# EAGLE design samd21_actuatorhub_pro_1.0.1_may2023 (EAGLE 9.6.2)
VERSION: V1.1 Jan 2022

## Sheet 1 of 3
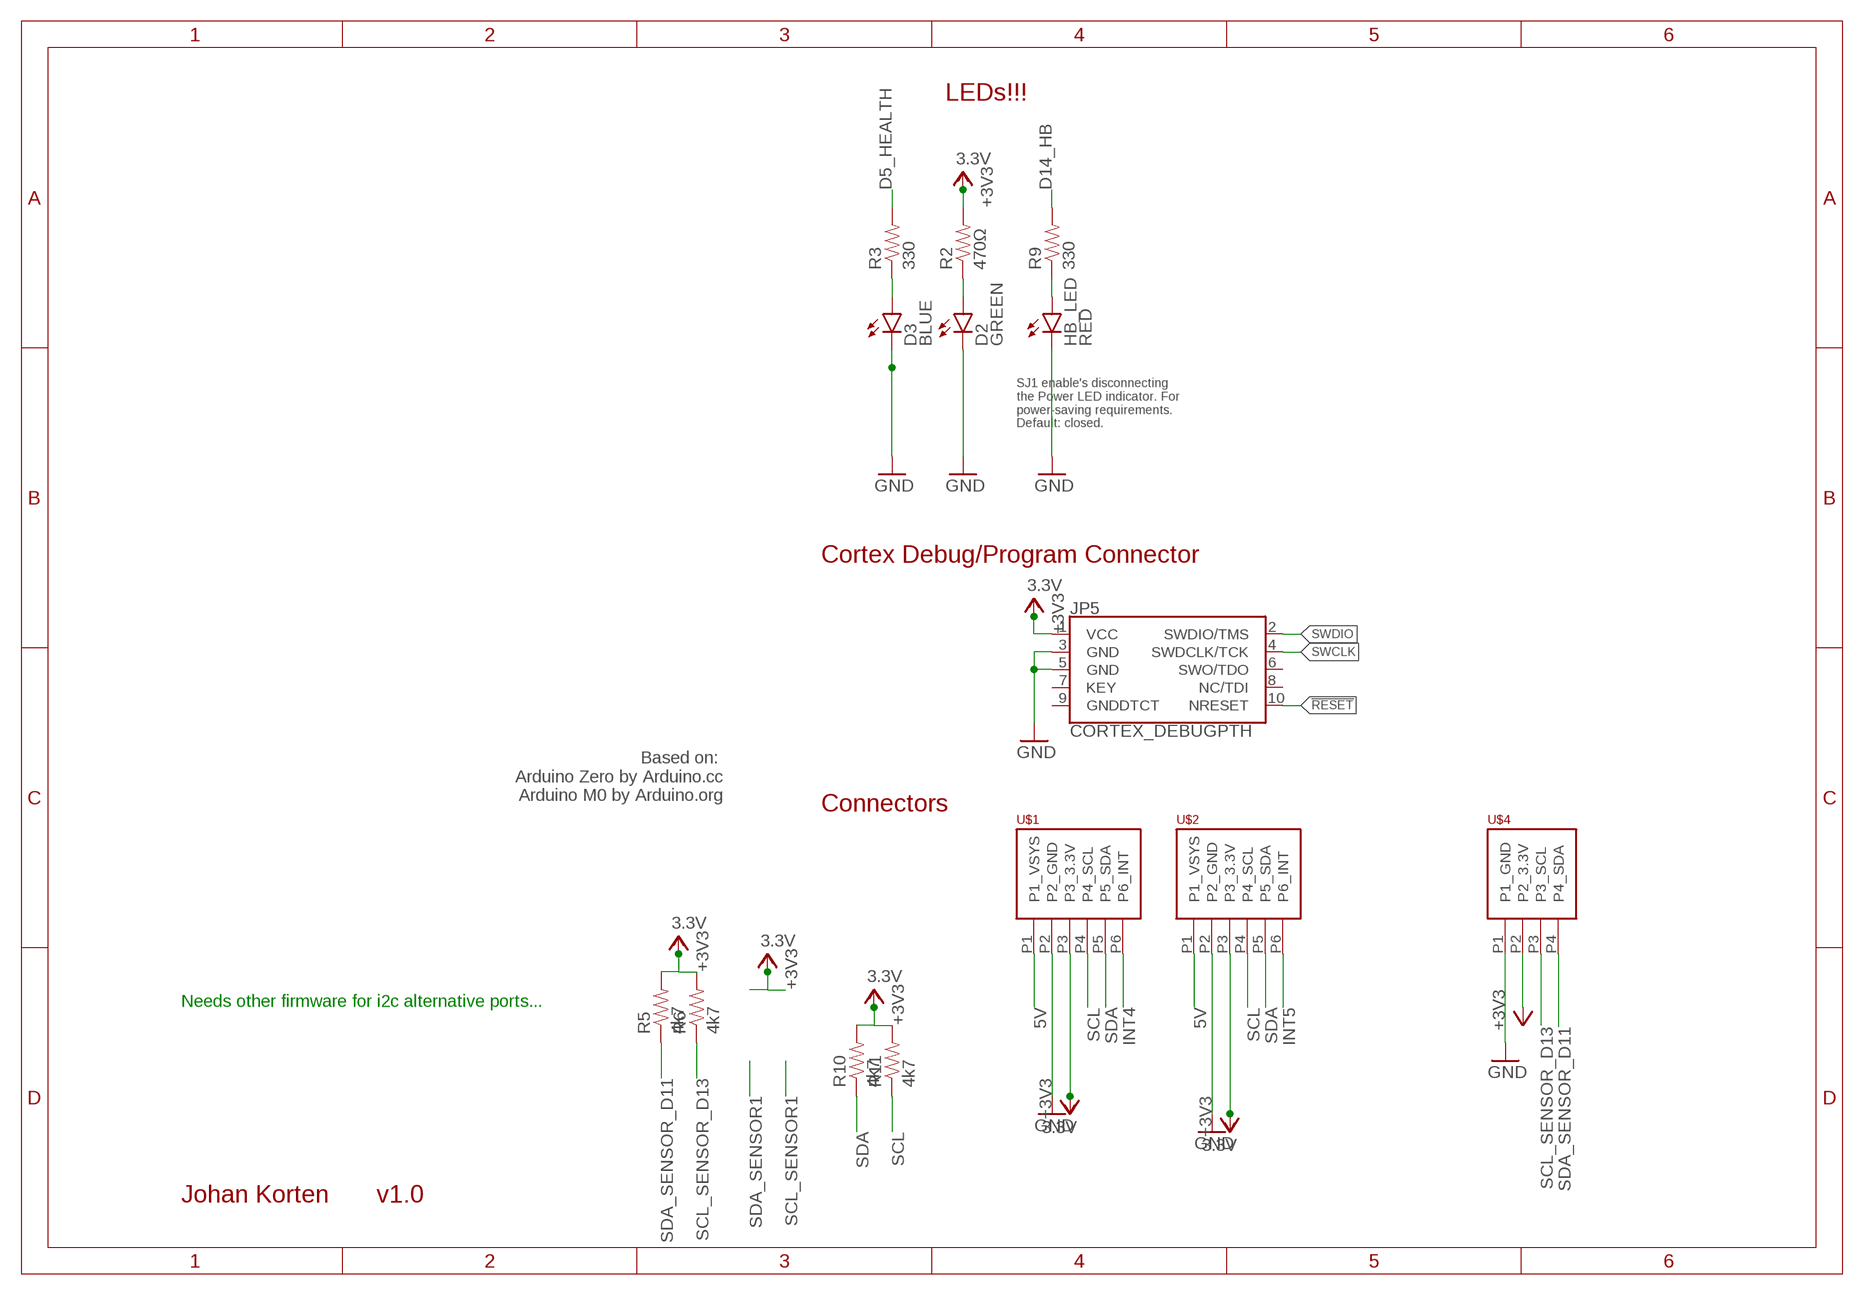
[diagram p0: schematic, sheet 1]

### Parts
D2  GREEN  LED-RED0603  [LED-0603]
D3  BLUE  LED-BLUE0603  [LED-0603]
HB_LED  RED  LED-RED0603  [LED-0603]
JP5  CORTEX_DEBUGPTH  [2X5-PTH-1.27MM]
R2  470Ω  330OHM1/10W1%(0603)  [0603-RES]
R3  330  330OHM1/10W1%(0603)  [0603-RES]
R5  4k7  330OHM1/10W1%(0603)  [0603-RES]
R6  4k7  330OHM1/10W1%(0603)  [0603-RES]
R9  330  330OHM1/10W1%(0603)  [0603-RES]
R10  4k7  330OHM1/10W1%(0603)  [0603-RES]
R11  4k7  330OHM1/10W1%(0603)  [0603-RES]
U$1  PHOENIX_PTSM_M6_TH_I2CPPANGLE  [PTSM_M6_THRHOLE]
U$2  PHOENIX_PTSM_M6_TH_I2CPPANGLE  [PTSM_M6_THRHOLE]
U$4  PHOENIX_PTSM_M4_THANGLE  [PTSM_M4_TH]

### Nets
3.3V [power]: JP5.1(VCC) R2.2 R5.2 R6.2 R10.2 R11.2 U$1.P3(P3_3.3V) U$2.P3(P3_3.3V) U$4.P2(P2_3.3V) ; supply symbol labelled +3V3 ; also sheet 2
5V [power]: U$1.P1(P1_VSYS) U$2.P1(P1_VSYS) ; also sheet 2,3
!RESET: JP5.10(NRESET) ; also sheet 2
D5_HEALTH: R3.2 ; also sheet 2
D5_HEALTH_LED: D3.A R3.1
D14_HB: R9.2 ; also sheet 2
D14_HB_LED: HB_LED.A R9.1
GND [ground]: D2.C D3.C HB_LED.C JP5.3(GND) JP5.5(GND) U$1.P2(P2_GND) U$2.P2(P2_GND) U$4.P1(P1_GND) ; also sheet 2,3
INT4: U$1.P6(P6_INT) ; also sheet 2
INT5: U$2.P6(P6_INT) ; also sheet 2
N$5: D2.A R2.1
SCL: R11.1 U$1.P4(P4_SCL) U$2.P4(P4_SCL) ; also sheet 2
SCL_SENSOR_D13: R6.1 U$4.P3(P3_SCL) ; also sheet 2
SDA: R10.1 U$1.P5(P5_SDA) U$2.P5(P5_SDA) ; also sheet 2
SDA_SENSOR_D11: R5.1 U$4.P4(P4_SDA) ; also sheet 2
SWCLK: JP5.4(SWDCLK/TCK) ; also sheet 2
SWDIO: JP5.2(SWDIO/TMS) ; also sheet 2
Unconnected: JP5.6(SWO/TDO) JP5.7(KEY) JP5.8(NC/TDI) JP5.9(GNDDTCT)

### Notes on the sheet
- LEDs!!!
- SJ1 enable's disconnecting
  the Power LED indicator. For
  power-saving requirements.
  Default: closed.
- Cortex Debug/Program Connector
- Based on: 
  Arduino Zero by Arduino.cc
  Arduino M0 by Arduino.org
- Connectors
- Needs other firmware for i2c alternative ports...
- Johan Korten | v1.0

## Sheet 2 of 3: Controller SAMD21 based on Adafruit Feather M0 Express
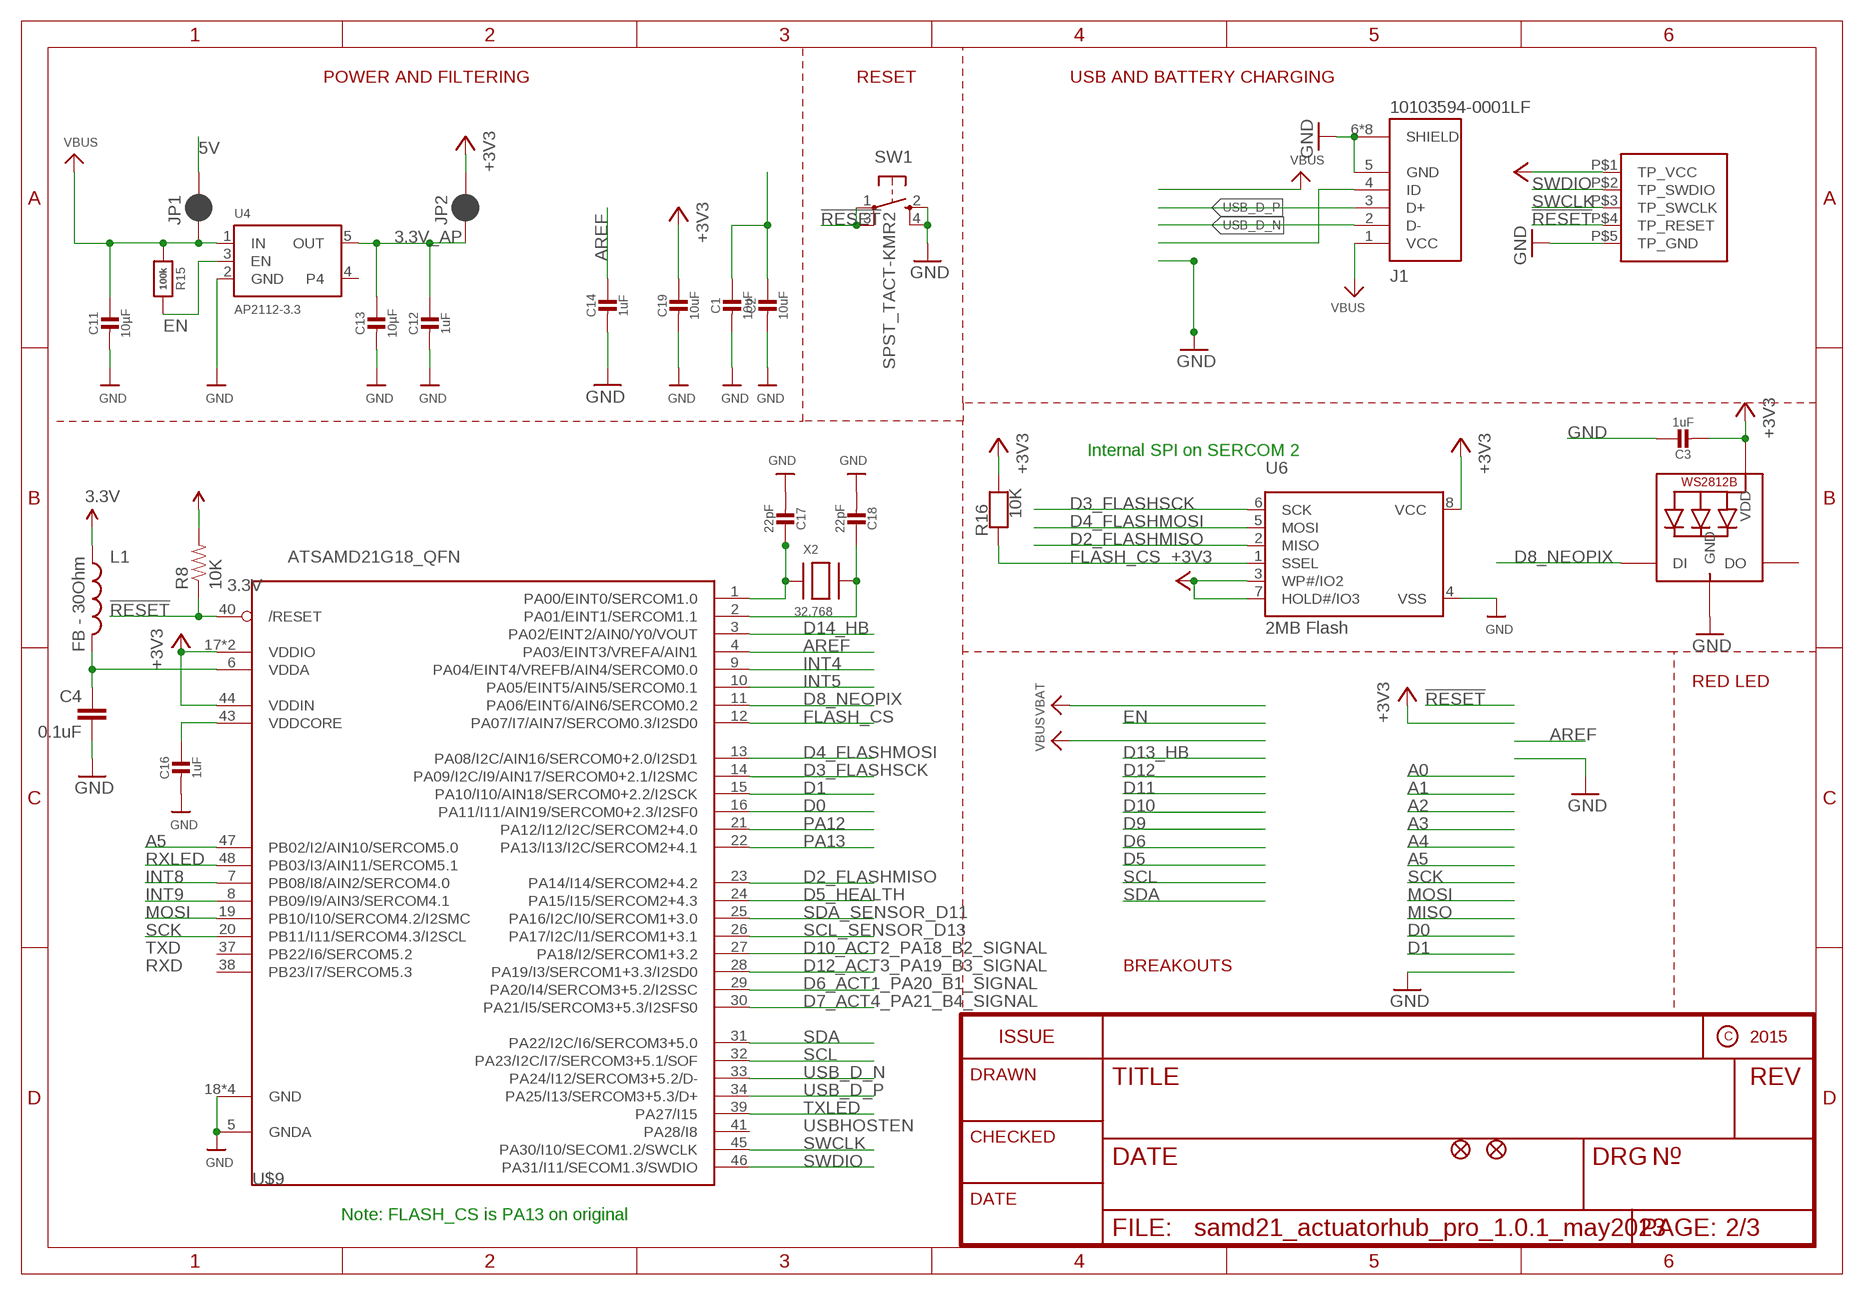
[diagram p1: schematic, sheet 2]

### Parts
C1  10uF  CAP_CERAMIC0805-NOOUTLINE  [0805-NO]
C2  10uF  CAP_CERAMIC0805-NOOUTLINE  [0805-NO]
C3  1uF  CAP_CERAMIC0603_NO  [0603-NO]
C4  0.1uF  0.1UF-16V(+-10%)(0402)  [0402-CAP]
C11  10µF  CAP_CERAMIC0805-NOOUTLINE  [0805-NO]
C12  1uF  CAP_CERAMIC0603_NO  [0603-NO]
C13  10µF  CAP_CERAMIC0805-NOOUTLINE  [0805-NO]
C14  1uF  CAP_CERAMIC0603_NO  [0603-NO]
C16  1uF  CAP_CERAMIC0603_NO  [0603-NO]
C17  22pF  CAP_CERAMIC0603_NO  [0603-NO]
C18  22pF  CAP_CERAMIC0603_NO  [0603-NO]
C19  10uF  CAP_CERAMIC0805-NOOUTLINE  [0805-NO]
J1  10103594-0001LF  [AMPHENOL_10103594-0001LF]
JP1  JUMPER-SMT_2_NC_PASTE_SILK  [SMT-JUMPER_2_NC_PASTE_SILK]
JP2  JUMPER-SMT_2_NC_PASTE_SILK  [SMT-JUMPER_2_NC_PASTE_SILK]
L1  FB - 30Ohm  INDUCTOR0603  [0603]
LED1  WS2812B3535  [LED3535]
R8  10K  10KOHM-1/10W-1%(0603)0603  [0603-RES]
R15  100k  RESISTOR_0603_NOOUT  [0603-NO]
R16  10K  RESISTOR_0603_NOOUT  [0603-NO]
SW1  SPST_TACT-KMR2  [KMR2]
U4  AP2112-3.3  VREG_SOT23-5  [SOT23-5]
U6  2MB Flash  SPIFLASH_SOIC8208MIL  [SOIC8_208MIL]
U$5  HUB_TESTPINSHUBS  [TEST_PINS]
U$9  ATSAMD21G18_QFN  ATSAMD21G_QFN  [TQFN48_7MM]
U$34  FIDUCIAL""  [FIDUCIAL_1MM]
U$35  FIDUCIAL""  [FIDUCIAL_1MM]
X2  32.768  XTAL-3.2X1.5  [XTAL3215]

### Nets
3.3V [power]: C3.2 C19.1 JP2.2 L1.1 LED1.2(VDD) R8.2 R16.2 U6.3(WP#/IO2) U6.7(HOLD#/IO3) U6.8(VCC) U$5.P$1(TP_VCC) U$9.17(VDDIO) U$9.36(VDDIO) U$9.44(VDDIN) ; supply symbol labelled +3V3 ; also sheet 1
3.3V_AP [power]: C12.1 C13.1 JP2.1 U4.5(OUT)
5V [power]: C1.1 C2.1 JP1.2 ; also sheet 1,3
!RESET: R8.1 SW1.1(P) SW1.3(P1) U$5.P$4(TP_RESET) U$9.40(/RESET) ; also sheet 1
A5: U$9.47(PB02/I2/AIN10/SERCOM5.0)
AREF [power]: C14.1 U$9.4(PA03/EINT3/VREFA/AIN1)
D0: U$9.16(PA11/I11/AIN19/SERCOM0+2.3/I2SF0)
D1: U$9.15(PA10/I10/AIN18/SERCOM0+2.2/I2SCK)
D2_FLASHMISO: U6.2(MISO) U$9.23(PA14/I14/SERCOM2+4.2)
D3_FLASHSCK: U6.6(SCK) U$9.14(PA09/I2C/I9/AIN17/SERCOM0+2.1/I2SMC)
D4_FLASHMOSI: U6.5(MOSI) U$9.13(PA08/I2C/AIN16/SERCOM0+2.0/I2SD1)
D5_HEALTH: U$9.24(PA15/I15/SERCOM2+4.3) ; also sheet 1
D6_ACT1_PA20_B1_SIGNAL: U$9.29(PA20/I4/SERCOM3+5.2/I2SSC) ; also sheet 3
D7_ACT4_PA21_B4_SIGNAL: U$9.30(PA21/I5/SERCOM3+5.3/I2SFS0) ; also sheet 3
D8_NEOPIX: LED1.1(DI) U$9.11(PA06/EINT6/AIN6/SERCOM0.2)
D10_ACT2_PA18_B2_SIGNAL: U$9.27(PA18/I2/SERCOM1+3.2) ; also sheet 3
D12_ACT3_PA19_B3_SIGNAL: U$9.28(PA19/I3/SERCOM1+3.3/I2SD0) ; also sheet 3
D14_HB: U$9.3(PA02/EINT2/AIN0/Y0/VOUT) ; also sheet 1
EN: R15.2 U4.3(EN)
FLASH_CS: R16.1 U6.1(SSEL) U$9.12(PA07/I7/AIN7/SERCOM0.3/I2SD0)
GND [ground]: C1.2 C2.2 C3.1 C4.2 C11.2 C12.2 C13.2 C14.2 C16.2 C17.2 C18.2 C19.2 J1.5(GND) J1.6(SHIELD) J1.7(SHIELD) J1.8(SHIELD) J1.9(SHIELD) J1.10(SHIELD) J1.11(SHIELD) J1.S1(SHIELD) J1.S2(SHIELD) LED1.4(GND) SW1.2(S) SW1.4(S1) U4.2(GND) U6.4(VSS) U$5.P$5(TP_GND) U$9.5(GNDA) U$9.18(GND) U$9.35(GND) U$9.42(GND) U$9.THERMAL(GND) ; also sheet 1,3
INT4: U$9.9(PA04/EINT4/VREFB/AIN4/SERCOM0.0) ; also sheet 1
INT5: U$9.10(PA05/EINT5/AIN5/SERCOM0.1) ; also sheet 1
INT8: U$9.7(PB08/I8/AIN2/SERCOM4.0)
INT9: U$9.8(PB09/I9/AIN3/SERCOM4.1)
MOSI: U$9.19(PB10/I10/SERCOM4.2/I2SMC)
N$8: J1.4(ID)
N$15: C17.1 U$9.1(PA00/EINT0/SERCOM1.0) X2.P$1
N$17: C18.1 U$9.2(PA01/EINT1/SERCOM1.1) X2.P$2
PA12: U$9.21(PA12/I12/I2C/SERCOM2+4.0)
PA13: U$9.22(PA13/I13/I2C/SERCOM2+4.1)
RXLED: U$9.48(PB03/I3/AIN11/SERCOM5.1)
SCK: U$9.20(PB11/I11/SERCOM4.3/I2SCL)
SCL: U$9.32(PA23/I2C/I7/SERCOM3+5.1/SOF) ; also sheet 1
SCL_SENSOR_D13: U$9.26(PA17/I2C/I1/SERCOM1+3.1) ; also sheet 1
SDA: U$9.31(PA22/I2C/I6/SERCOM3+5.0) ; also sheet 1
SDA_SENSOR_D11: U$9.25(PA16/I2C/I0/SERCOM1+3.0) ; also sheet 1
SWCLK: U$5.P$3(TP_SWCLK) U$9.45(PA30/I10/SECOM1.2/SWCLK) ; also sheet 1
SWDIO: U$5.P$2(TP_SWDIO) U$9.46(PA31/I11/SECOM1.3/SWDIO) ; also sheet 1
TXLED: U$9.39(PA27/I15)
USB_D_N [usb]: J1.2(D-) U$9.33(PA24/I12/SERCOM3+5.2/D-)
USB_D_P [usb]: J1.3(D+) U$9.34(PA25/I13/SERCOM3+5.3/D+)
VBUS [power]: C11.1 J1.1(VCC) JP1.1 R15.1 U4.1(IN)
VDDANA: C4.1 L1.2 U$9.6(VDDA)
VDDCORE1: C16.1 U$9.43(VDDCORE)
Unconnected: LED1.3(DO) U4.4 U$9.37(PB22/I6/SERCOM5.2) U$9.38(PB23/I7/SERCOM5.3) U$9.41(PA28/I8)

### Notes on the sheet
- POWER AND FILTERING | RESET | USB AND BATTERY CHARGING
- Internal SPI on SERCOM 2
- RED LED
- TXD
- RXD | BREAKOUTS
- USBHOSTEN
- Note: FLASH_CS is PA13 on original

## Sheet 3 of 3
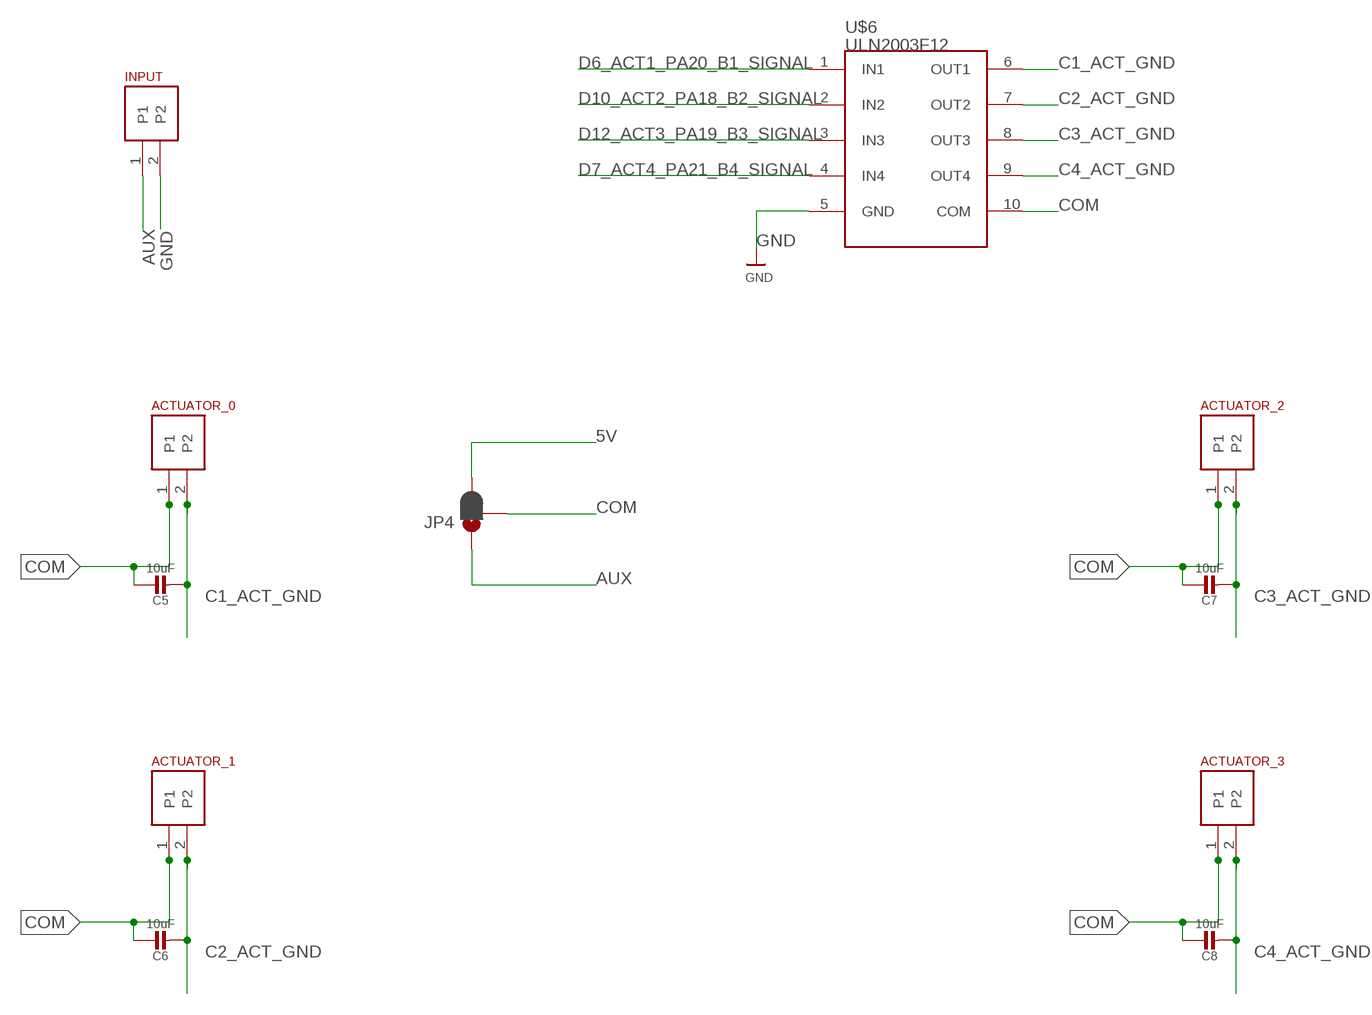
[diagram p2: schematic, sheet 3]

### Parts
ACTUATOR_0  PHOENIX_PTSM_M2_TH  [PTSM_M2_THRHOLE]
ACTUATOR_1  PHOENIX_PTSM_M2_TH  [PTSM_M2_THRHOLE]
ACTUATOR_2  PHOENIX_PTSM_M2TH  [PTSM_M2_THRHOLE]
ACTUATOR_3  PHOENIX_PTSM_M2TH  [PTSM_M2_THRHOLE]
C5  10uF  CAP_CERAMIC0805-NOOUTLINE  [0805-NO]
C6  10uF  CAP_CERAMIC0805-NOOUTLINE  [0805-NO]
C7  10uF  CAP_CERAMIC0805-NOOUTLINE  [0805-NO]
C8  10uF  CAP_CERAMIC0805-NOOUTLINE  [0805-NO]
INPUT  PHOENIX_PTSM_M2_TH  [PTSM_M2_THRHOLE]
JP4  JUMPER-SMT_3_1-NC_PASTE_SILK  [SMT-JUMPER_3_1-NC_PASTE_SILK]
U$6  ULN2003F12  [U-DFN3030-10]

### Nets
5V [power]: JP4.3 ; also sheet 1,2
AUX: INPUT.1 JP4.1
C1_ACT_GND: ACTUATOR_0.2 C5.2 U$6.6(OUT1)
C2_ACT_GND: ACTUATOR_1.2 C6.2 U$6.7(OUT2)
C3_ACT_GND: ACTUATOR_2.2 C7.2 U$6.8(OUT3)
C4_ACT_GND: ACTUATOR_3.2 C8.2 U$6.9(OUT4)
COM: ACTUATOR_0.1 ACTUATOR_1.1 ACTUATOR_2.1 ACTUATOR_3.1 C5.1 C6.1 C7.1 C8.1 JP4.2 U$6.10(COM)
D6_ACT1_PA20_B1_SIGNAL: U$6.1(IN1) ; also sheet 2
D7_ACT4_PA21_B4_SIGNAL: U$6.4(IN4) ; also sheet 2
D10_ACT2_PA18_B2_SIGNAL: U$6.2(IN2) ; also sheet 2
D12_ACT3_PA19_B3_SIGNAL: U$6.3(IN3) ; also sheet 2
GND [ground]: INPUT.2 U$6.5(GND) ; also sheet 1,2

## Library data of the parts
ACTUATOR_0 ACTUATOR_1 INPUT = jk_customs:PHOENIX_PTSM_M2_TH
ACTUATOR_2 ACTUATOR_3 = jk_customs:PHOENIX_PTSM_M2
C1-C3 C5-C8 C11-C14 C16-C19 = microbuilder:CAP_CERAMIC: Ceramic Capacitors For new designs, use the packages preceded by an '_' character since they are more reliable: The following footprints should be used on most boards: _0402 - Standard footprint for regular board layouts _0603 - Standard footprint for regular board layouts _0805 - Standard footprint for regular board layouts _1206 - Standard footprint for regular board layouts For extremely tight-pitch boards where space is at a premium, the following 'micro-pitch' footprints can be used (smaller pads, no silkscreen outline, etc.): _0402MP - Micro-pitch footprint for very dense/compact boards _0603MP - Micro-pitch footprint for very dense/compact boards _0805MP - Micro-pitch footprint for very dense/compact boards _1206MP - Micro-pitch footprint for very dense/compact boards
C4 = SparkFun-Capacitors:0.1UF-16V(+-10%)(0402); PROD_ID: CAP-12416
D2 = SparkFun-LED:LED-RED: Assorted Red LEDs LilyPad 1206- DIO-09912 1206- DIO-00809 0603- DIO-00819 "SMART" means more efficient and expensive; PROD_ID: DIO-00819; VALUE: RED
D3 = SparkFun-LED:LED-BLUE: Blue LEDs for production use Various blue LEDs stocked by SparkFun production 0603 - DIO-08575 Rebel - DIO-09553 1206 - DIO-09911; PROD_ID: DIO-08575
HB_LED = SparkFun-LED:LED-RED: Assorted Red LEDs LilyPad 1206- DIO-09912 1206- DIO-00809 0603- DIO-00819 "SMART" means more efficient and expensive; PROD_ID: DIO-00819
J1 = 10103594-0001LF:10103594-0001LF: USB - micro B USB 2.0 Receptacle Connector 5 Position Surface Mount, Right Angle; Through Hole Check availability <https://pricing.snapeda.com/parts/10103594-0001LF/AMPHENOL%20ICC%20/%20FCI/view-part?ref=eda>; AVAILABILITY: In Stock; DESCRIPTION: Micro USB 2.0, Input Output Connectors, B TYPE RECEPTACLE; MF: AMPHENOL ICC / FCI; MP: 10103594-0001LF; PACKAGE: None; PRICE: None; PURCHASE-URL: https://pricing.snapeda.com/search/part/10103594-0001LF/?ref=eda
JP1 JP2 = SparkFun-Jumpers:JUMPER-SMT_2_NC_PASTE: Normally closed solder jumper This jumper has an aperture in the stencil to allow solder paste to bridge the split in the wire so it's normally closed (NC). Wick off the solder to open the connection. Reapply solder to reclose the connection.
JP4 = SparkFun-Jumpers:JUMPER-SMT_3_1-NC_PASTE: Normally closed solder jumper (1 of 2 connections) This jumper has an aperture in the stencil to allow solder paste to bridge one of the two connections. One connection is normally closed (NC), while the other is normally open (NO). Wick off the solder to open the connection. Reapply solder to reclose the connection. Apply solder to the other side instead to change the current path.
JP5 = samd21-temp:CORTEX_DEBUG: Cortex Debug Connector Datasheet <http://infocenter.arm.com/help/topic/com.arm.doc.faqs/attached/13634/cortex_debug_connectors.pdf>
L1 = SparkFun-Passives:INDUCTOR: Inductors Basic Inductor/Choke - 0603 and 1206. Footprints are not proven and vary greatly between part numbers. INDUCTOR POWER 3.3UH 4.0A SMD 0.197" L x 0.197" W x 0.177" H (5.00mm x 5.00mm x 4.50mm); PROD_ID: RES-07859
LED1 = microbuilder:WS2812B
R2 R5 R6 R10 R11 = SparkFun-Resistors:330OHM1/10W1%(0603): RES-00818; PROD_ID: RES-00818; VALUE: 330
R3 R9 = SparkFun-Resistors:330OHM1/10W1%(0603): RES-00818; PROD_ID: RES-00818
R8 = SparkFun-Resistors:10KOHM-1/10W-1%(0603): RES-00824; PROD_ID: RES-00824
R15 R16 = microbuilder:RESISTOR: Resistors For new designs, use the packages preceded by an '_' character since they are more reliable: The following footprints should be used on most boards: _0402 - Standard footprint for regular board layouts _0603 - Standard footprint for regular board layouts _0805 - Standard footprint for regular board layouts _1206 - Standard footprint for regular board layouts For extremely tight-pitch boards where space is at a premium, the following 'micro-pitch' footprints can be used (smaller pads, no silkscreen outline, etc.): _0402MP - Micro-pitch footprint for very dense/compact boards _0603MP - Micro-pitch footprint for very dense/compact boards _0805MP - Micro-pitch footprint for very dense/compact boards _1206MP - Micro-pitch footprint for very dense/compact boards
SW1 = adafruit:SPST_TACT: SMT 6mm switch, EVQQ2 series http://www.ladyada.net/library/eagle
U4 = microbuilder:VREG_SOT23-5: SOT23-5 Fixed Voltage Regulators Part Current Out V Out V In V Dropout θJA (°C/W) TJ (°C) Digikey Part No. ADP121 150mA 3.3V 3.4-5.5V 0.09V @ 150mA -- -- ADP121-AUJZ33R7CT-ND ADP121 150mA 3.0V 3.1-5.5V 0.09V @ 150mA -- -- ADP121-AUJZ30R7CT-ND ADP122 300mA 3.3V 3.4-5.5V 0.085V @ 300mA -- -- ADP122AUJZ-3.3-R7CT-ND ADP1712 300mA 3.3V 3.5-5.5V 0.17V @ 300mA -- -- ADP1712AUJZ-3.3-R7TR-ND AP7311 (Low Cost) 150mA 3.3V 3.5-6V 0.15V @ 150mA -- -- AP7311-33WG-7DICT-ND LD39015M18R 150mA 1.8V 1.9V-5.5V 0.08V @ 100mA -- -- 497-6977-1-ND LP2985A-33DBVR 150mA 3.3V 3.3-16V 0.28V @ 150mA 206 150 296-18479-1-ND MCP1824T-3302E/OT 300mA 3.3V 3.5V-6V 0.2V @ 300mA -- -- MCP1824T-3302E/OTCT-ND MIC5205-2.5YM5 TR 150mA 2.5V 2.7-16V 0.165V @ 150mA -- -- 576-1257-2-ND MIC5205-3.0YM5 TR 150mA 3.0V 3.2V-16V 0.165V @ 150mA -- -- 576-1258-2-ND MIC5205-3.3YM5 TR 150mA 3.3V 3.5V-16V 0.165V @ 150mA -- -- 576-1259-2-ND TPS780330220 150mA 3.3V+2.2V 3.6-5.5V 250mV Max -- -- 296-23332-1-ND TDA3663/N1,135 100mA 3.3V 3.5-45V 0.18V @ 50mA -- -- 568-5343-1-ND Max operating temp can be calculated using θJA, TJ (max junction temperature), and power in watts. Set the "Maximum Ambient Temperature" until it reaches TJ ("Max Junction Temperature"), which is the absolute limit for safe use of the regulator: Heat Sink Temperature Calculator <http://www.daycounter.com/Calculators/Heat-Sink-Temperature-Calculator.phtml> For example, With 12V source into a 3.3V LP2985 and a 30mA load, we are dissipating (12V-3.3V) * 0.03A = 0.261W. With a θJA of 206 °C/W, a TJ of 150°C, and 261mW we can safely use the chip without a heat sink up to 75°C (=147.1°C Junction Temperature).
U6 = microbuilder:SPIFLASH_SOIC8: SOIC8 SPI Flash Be careful with the size since SOIC8 flash comes in several 'widths' SOIC8 150 mil M25P16 - 16Mbit (2Mbit x 8) Serial Flash (75MHz SPI Bus), Supply: 2.7-3.6V Digikey: SOIC8 - M25P16-VMN6P-ND SOIC8 208 mil W25Q16BVSSIG - 16Mbit (2Mbit x 8) Serial Flash (104MHz SPI Bus), Supply: 2.7-3.6V Digikey: SOIC8 - W25Q16BVSSIG-ND
U$1 U$2 = jk_customs:PHOENIX_PTSM_M6_TH_I2CPP
U$4 = jk_customs:PHOENIX_PTSM_M4_TH
U$5 = jk_customs:HUB_TESTPINS
U$6 = ULN2003F12:ULN2003F12: Check availability <https://pricing.snapeda.com/parts/ULN2003F12/Diodes%20Zetex/view-part?ref=eda>; AVAILABILITY: In Stock; DESCRIPTION: Pref DRVR Quad 10-Pin UDFN EP T/R; MF: Diodes Zetex; MP: ULN2003F12; PACKAGE: None; PRICE: None
U$9 = microbuilder:ATSAMD21G
U$34 U$35 = microbuilder:FIDUCIAL: Fiducial Alignment Points Various fiducial points for machine vision alignment.; BOM: EXCLUDE
X2 = adafruit2:XTAL: Low cost SMT crystals, no capacitors included http://www.ladyada.net/library/eagle

## Net classes
1 usb: width 0.152 mm, drill 0.254 mm, clearance 0.152 mm
2 ground: width 0.254 mm, drill 0.254 mm, clearance 0.152 mm
3 power: width 0.254 mm, drill 0.254 mm, clearance 0.152 mm

## Board
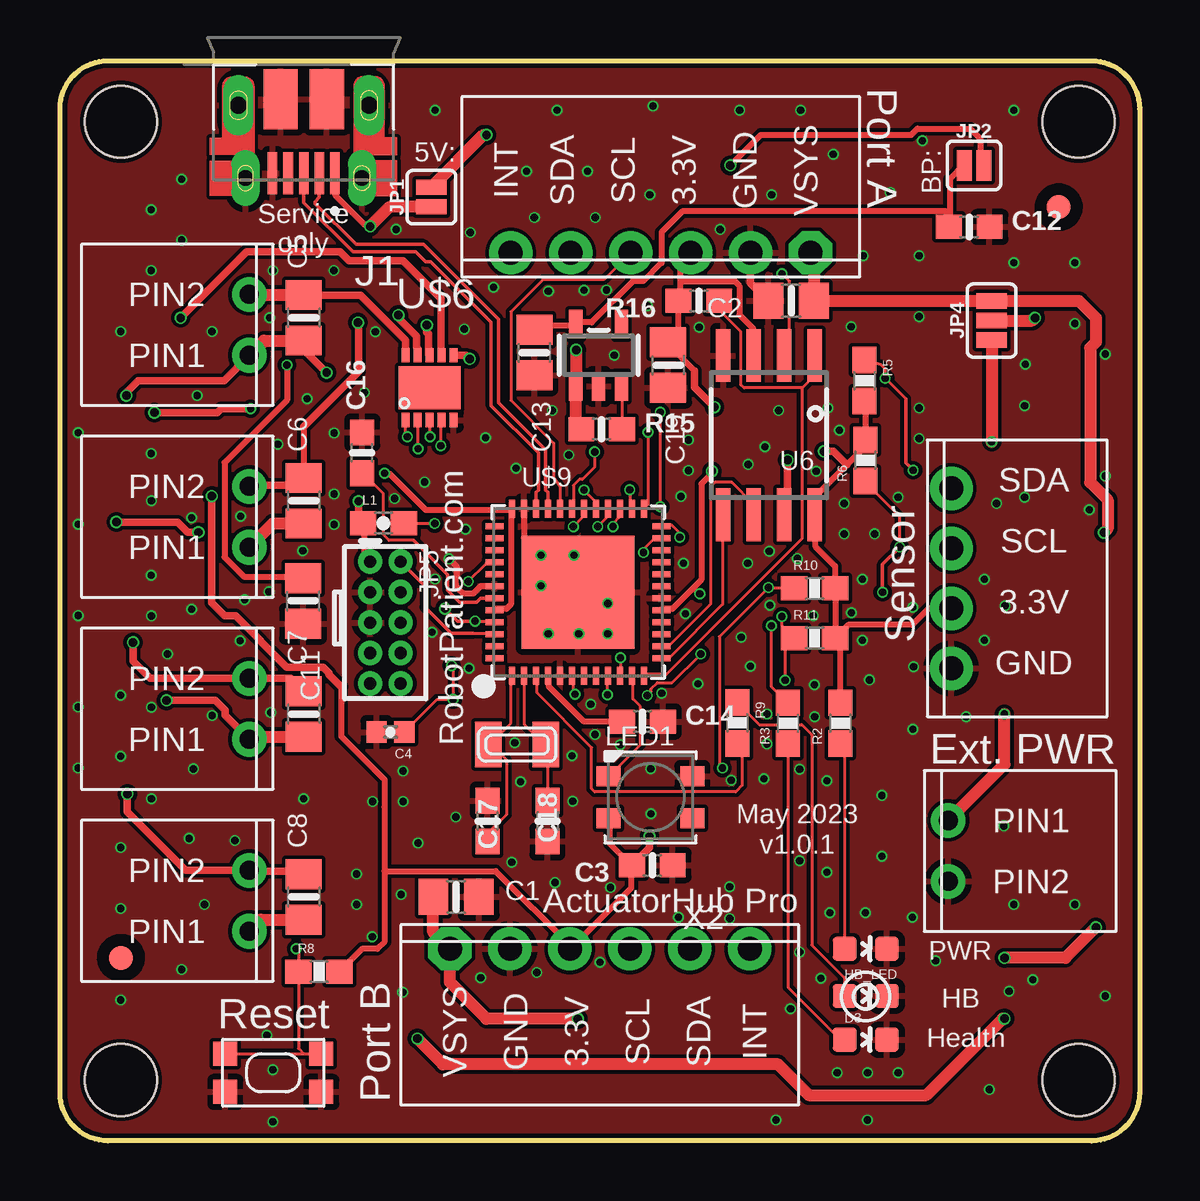
[diagram p3: board, top side]
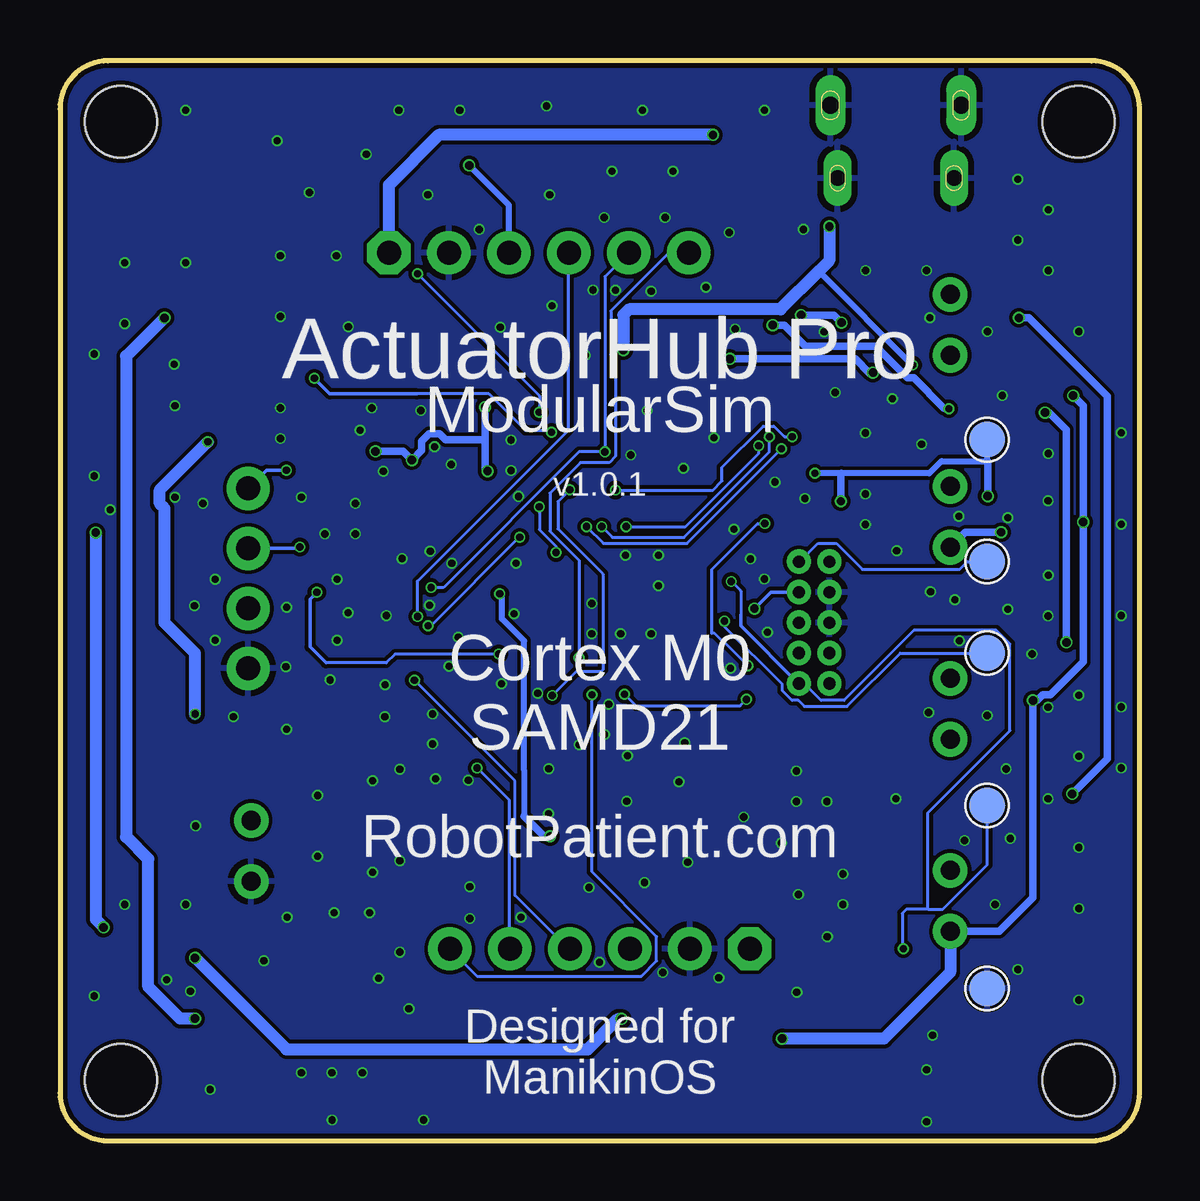
[diagram p4: board, bottom side, seen from below]

Size 45 x 45 mm. Coordinates in mm from the lower left corner, seen from the top.
Outline: 2,45 43,45 arc-90 45,43 45,2 arc-90 43,0 2,0 arc-90 0,2 0,43 arc-90 2,45
Copper layers (1*16): Top 0.035mm / dielectric 1.6mm / Bottom 0.035mm
Design rules "jlcpcb-2layers_2023": minimum track width 5mil, minimum drill 0.3mm, track to track 5mil, track to pad 5mil, pad to pad 5mil, via to via 5mil, smd to smd 5mil, copper to edge 0.2mm, drill to drill 6mil, minimum pad ring 10mil, minimum via ring 3mil, stop-mask expansion 4mil, vias tented up to drill 20mil, thermal gap 10mil
Holes 3 mm at 2.54,42.46 2.54,2.54 42.46,2.54 42.46,42.46

### Footprints (pad centres in the part's own frame; a part is rotated, then mirrored left to right if it is on the bottom)
PTSM_M2_THRHOLE = drill 0.8: 1 -1.27,1; 2 1.27,1
0805-NO = smd 1.24 x 1.5: 1 -0.95,0; 2 0.95,0
0603-NO = smd 1.075 x 1: 1 -0.85,0; 2 0.85,0
0402-CAP = smd 0.85 x 0.9: 1 -0.58,0; 2 0.58,0
LED-0603 = smd 1 x 1: A 0,-0.877; C 0,0.877
AMPHENOL_10103594-0001LF = smd 0.4 x 1.75: 1 -1.3,2.825; 2 -0.65,2.825; 3 0,2.825; 4 0.65,2.825; 5 1.3,2.825 | drill 0.65 pad 0.73 long: 6 -2.425,3.03; 7 2.425,3.03 | drill 0.7 pad 1.2 long: 8 -2.725,0; 9 2.725,0 | smd 1.05 x 2.1 bottom: 10 -2.425,3.03; 11 2.425,3.03 | smd 1.425 x 2.5: S1 -0.963,-0.25; S2 0.963,-0.25
SMT-JUMPER_2_NC_PASTE_SILK = smd 0.635 x 1.27: 1 -0.406,0; 2 0.406,0
SMT-JUMPER_3_1-NC_PASTE_SILK = smd 0.635 x 1.27: 1 -0.813,0; 2 0,0; 3 0.813,0
2X5-PTH-1.27MM = drill 0.508 pad 1: 1 -2.54,-0.635; 2 -2.54,0.635; 3 -1.27,-0.635; 4 -1.27,0.635; 5 0,-0.635; 6 0,0.635; 7 1.27,-0.635; 8 1.27,0.635; 9 2.54,-0.635; 10 2.54,0.635
0603 = smd 1.1 x 1: 1 -0.85,0; 2 0.85,0
LED3535 = smd 1 x 0.85: 1 -1.75,0.875; 2 -1.75,-0.875; 3 1.75,-0.875; 4 1.75,0.875
0603-RES = smd 1.1 x 1: 1 -0.85,0; 2 0.85,0
KMR2 = smd 1 x 1: 1 2,0.8; 2 2,-0.8; 3 -2,0.8; 4 -2,-0.8
SOT23-5 = smd 0.55 x 1.2: 1 -0.95,-1.3; 2 0,-1.3; 3 0.95,-1.3; 4 0.95,1.3; 5 -0.95,1.3
SOIC8_208MIL = smd 0.6 x 2.2: 1 -1.905,-3.315; 2 -0.635,-3.315; 3 0.635,-3.315; 4 1.905,-3.315; 5 1.905,3.315; 6 0.635,3.315; 7 -0.635,3.315; 8 -1.905,3.315
PTSM_M6_THRHOLE = drill 1 octagon: P1 6.25,1 | drill 1: P2 3.75,1; P3 1.25,1; P4 -1.25,1; P5 -3.75,1; P6 -6.25,1
PTSM_M4_TH = drill 1: P1 3.75,1; P2 1.25,1; P3 -1.25,1; P4 -3.75,1
TEST_PINS = smd 1.5 x 1.5 bottom: P$1 6.35,29.21; P$2 6.35,24.13; P$3 6.35,20.32; P$4 6.35,13.97; P$5 6.35,6.35
U-DFN3030-10 = smd 0.35 x 0.6: 1 -1,-1.35; 2 -0.5,-1.35; 3 0,-1.35; 4 0.5,-1.35; 5 1,-1.35; 6 -1,1.35; 7 -0.5,1.35; 8 0,1.35; 9 0.5,1.35; 10 1,1.35 | smd 2.6 x 1.8: P$1 0,0
TQFN48_7MM = smd 0.25 x 0.75: 1 -2.75,-3.475; 2 -2.25,-3.475; 3 -1.75,-3.475; 4 -1.25,-3.475; 5 -0.75,-3.475; 6 -0.25,-3.475; 7 0.25,-3.475; 8 0.75,-3.475; 9 1.25,-3.475; 10 1.75,-3.475; 11 2.25,-3.475; 12 2.75,-3.475; 25 2.75,3.475; 26 2.25,3.475; 27 1.75,3.475; 28 1.25,3.475; 29 0.75,3.475; 30 0.25,3.475; 31 -0.25,3.475; 32 -0.75,3.475; 33 -1.25,3.475; 34 -1.75,3.475; 35 -2.25,3.475; 36 -2.75,3.475 | smd 0.75 x 0.25: 13 3.475,-2.75; 14 3.475,-2.25; 15 3.475,-1.75; 16 3.475,-1.25; 17 3.475,-0.75; 18 3.475,-0.25; 19 3.475,0.25; 20 3.475,0.75; 21 3.475,1.25; 22 3.475,1.75; 23 3.475,2.25; 24 3.475,2.75; 37 -3.475,2.75; 38 -3.475,2.25; 39 -3.475,1.75; 40 -3.475,1.25; 41 -3.475,0.75; 42 -3.475,0.25; 43 -3.475,-0.25; 44 -3.475,-0.75; 45 -3.475,-1.25; 46 -3.475,-1.75; 47 -3.475,-2.25; 48 -3.475,-2.75 | smd 4.7 x 4.7: THERMAL 0,0
FIDUCIAL_1MM = smd 1 x 1: 1 0,0
XTAL3215 = smd 1.1 x 1.9: P$1 1.2,0; P$2 -1.2,0

### Placement (x,y rotation side)
ACTUATOR_0  8.89,34 90 top
ACTUATOR_1  8.89,26 90 top
ACTUATOR_2  8.89,18 90 top
ACTUATOR_3  8.89,10 90 top
C1  16.51,10.16 0 top
C2  30.48,35 180 top
C3  24.69,11.48 180 top
C4  13.78,17.03 180 top
C5  10.16,34.29 90 top
C6  10.16,26.67 90 top
C7  10.16,17.78 90 top
C8  10.16,10.16 90 top
C11  10.13,22.49 270 top
C12  37.9,38.07 0 top
C13  19.77,32.84 270 top
C14  24.28,17.46 0 top
C16  12.6,28.66 90 top
C17  17.83,13.32 90 top
C18  20.32,13.32 270 top
C19  25.35,32.32 270 top
D2  33.59,8 270 top
D3  33.59,4.21 270 top
HB_LED  33.59,6.03 270 top
INPUT  36.03,12.08 270 top
J1  10.16,43.14 180 top
JP1  15.48,39.32 90 top
JP2  38.1,40.64 0 top
JP4  38.84,34.18 90 top
JP5  13.56,21.59 270 top
L1  13.49,25.73 0 top
LED1  24.61,14.31 0 top
R2  32.54,17.4 90 top
R3  30.35,17.4 90 top
R5  33.54,31.67 270 top
R6  33.58,28.35 90 top
R8  10.79,7.05 0 top
R9  28.23,17.41 270 top
R10  31.46,23.01 0 top
R11  31.46,20.94 0 top
R15  22.58,29.64 0 top
R16  26.63,35 180 top
SW1  8.89,2.83 0 top
U4  22.45,32.73 0 top
U6  29.55,29.4 180 top
U$1  22.5,9 180 top
U$2  25.04,36 0 top
U$4  36.15,23.43 270 top
U$5  0,0 0 top
U$6  15.41,31.38 0 top
U$9  21.59,22.86 0 top
U$34  41.63,38.9 0 top
U$35  2.54,7.62 0 top
X2  19.05,16.51 180 top

### Tracks (layer width: path | path; a pad name or v marks a point on that pad's centre or on a via)
3.3V  (via drill 0.3, 0.35)
  Top 0.254: 18.8,26.29 18.8,22.35 18.61,22.16 18.16,22.16 U$9.44 | 18.8,26.29 U$9.36 | L1.1 12.7,25.72 12.7,24.32 12.89,24.13 JP5.1 | 18.8,26.29 15.24,26.29 13.72,27.81 v13.53,27.81 | LED1.2 22.92,13.4 22.92,12.38 23.81,11.49 C3.2 23.81,11.37 23.81,10.54 21.27,8 U$1.P3 21.27,8.13 18.16,11.24 13.53,11.24 | 11.72,18.91 11.72,16.85 13.54,15.04 13.54,13.93 13.53,13.91 13.53,11.24 | 26.42,23.05 26.73,23.37 26.73,27.37 27.18,27.81 | 26.42,23.05 25.53,22.16 25.08,22.16 U$9.17 | 30.16,26.67 30.16,26.1 U6.7 | 25.84,35.81 25.84,36.51 26.29,36.96 U$2.P3 | 25.84,35.81 25.84,35.12 R16.2 25.78,34.99 25.78,33.66 25.4,33.27 C19.1 25.4,33.15 26.45,32.09 | 25.84,35.81 28.13,35.81 28.32,35.62 28.32,34.42 28.89,33.85 28.89,32.77 U6.3 | R5.2 33.59,30.8 33.59,29.21 R6.2 33.53,29.08 33.53,28.89 32.8,28.16 31.5,26.86 31.5,26.16 U6.8 31.5,26.04 31.5,24.75 32.31,23.94 R10.2 32.32,22.99 32.32,20.95 | 32.32,20.95 R11.2 32.32,20.83 32.51,20.64 32.51,18.29 R2.2 | v26.67,22.8 26.42,23.05 | R8.2 12.59,7.99 13.23,7.99 13.53,8.29 13.53,11.24 | v27.94,40.64 29.21,41.91 35.48,41.91 35.74,42.17 37.94,42.17 38.37,41.75 38.37,40.64 JP2.2 | 32.32,20.95 32.86,21.49 35.53,21.49 36.22,22.18 U$4.P2
  Top 0.305: L1.1 12.45,25.92 v12.45,26.64 | v6.33,26.86 6.33,22.41 6.87,21.87 7.31,21.87 9.46,19.73 10.96,19.73 11.21,19.48 11.21,19.42 11.72,18.91 | v24.57,12.69 24.57,12.22 C3.2 | 26.45,32.09 26.45,31.39 v27.28,30.57 | v27.18,27.9 27.18,27.81 | v30.33,28.36 30.33,26.84 30.16,26.67 | 32.8,28.16 32.23,28.73 v31.85,28.73
  Bottom 0.254: U$5.P$1 6.35,28.32 8.26,28.32 8.76,27.81 12.43,27.81 v13.53,27.81 | 25.65,13.53 25.65,15.24 25.65,15.43 25.65,20.82 26.58,21.75 26.58,22.7 v26.67,22.8 | U$2.P3 26.29,38.99 v27.94,40.64
  Bottom 0.305: v12.45,26.64 12.45,27.8 12.43,27.81 | 6.35,28.32 6.33,28.3 v6.33,26.86 | 25.65,13.53 24.82,12.69 v24.57,12.69 | v27.28,30.57 27.28,29.21 | 27.28,29.21 27.28,28 v27.18,27.9 | 27.28,29.21 28.93,29.21 29.17,29.45 29.61,29.45 29.92,29.14 29.92,28.77 v30.33,28.36 30.7,28.73 v31.85,28.73
3.3V_AP
  Top 0.254: C13.1 19.81,33.85 19.94,33.97 21.46,33.97 U4.5 21.59,34.1 22.16,34.1 23.88,35.81 24.32,35.81 25.08,36.58 25.08,37.86 25.95,38.72 36.94,38.72 C12.1 37.08,38.1 37.08,40.07 37.66,40.64 JP2.1
5V  (via drill 0.35)
  Top 0.508: U$2.P1 31.43,36.86 C2.1 31.44,34.99 JP4.3 42.48,34.99 43.18,34.29 43.18,33.28 42.94,33.04 42.94,27.44 43.67,26.7 43.67,25.5 v43.51,25.34 | JP1.2 17.67,41.91 v17.78,41.91 | v43.18,8.89 41.91,7.62 v39.37,7.62 | v21.59,5.08 17.78,5.08 16.25,6.61 U$1.P1 15.56,8.69 C1.1
  Bottom 0.508: U$2.P1 31.29,39.83 29.21,41.91 v17.78,41.91 | v43.51,25.34 43.51,9.22 v43.18,8.89 | v39.37,7.62 35.56,3.81 23,3.81 21.73,5.08 v21.59,5.08
!RESET  (via drill 0.3)
  Top 0.127: v17.02,23.3 17.78,24.07 18.1,24.07 U$9.40 | v9.84,8 9.95,7.9 R8.1 9.95,3.85 10.16,3.63 | SW1.3 10.16,3.63 | 10.16,3.63 SW1.1
  Bottom 0.127: v17.02,23.3 16.62,22.91 16.62,21.92 | 14.22,19.05 JP5.10 13.97,19.05 13.27,18.35 12.32,18.35 9.4,21.27 5.97,21.27 5.4,20.7 5.4,17.09 8.83,13.66 8.83,9.65 | U$5.P$4 6.35,11.49 8.19,9.65 8.83,9.65 | 8.83,9.65 9.72,9.65 9.89,9.47 9.89,8.05 v9.84,8
  Bottom 0.15: 16.62,21.92 16.62,21.45 14.22,19.05
AREF
  Top 0.254: C14.1 21.84,17.46 20.38,18.92 20.38,19.37 U$9.4
AUX  (via drill 0.3)
  Top 0.508: JP4.1 v38.84,29.12 | INPUT.1 39.37,15.69 v39.37,17.78
  Bottom 0.508: v39.37,17.78 39.37,20.32 40.64,21.59 40.64,26.35 40.84,26.55 40.84,27.12 v38.84,29.12
C1_ACT_GND
  Top 0.127: C5.2
  Top 0.305: C5.2 12.53,35.24 14.41,33.35 U$6.6
  Top 0.508: ACTUATOR_0.2 7.92,35.24 C5.2
C2_ACT_GND  (via drill 0.35)
  Top 0.127: 7.94,27.3 ACTUATOR_1.2
  Top 0.254: 10.16,29.76 C6.2 9.85,27.3
  Top 0.305: 9.85,27.3 7.94,27.3 | 10.16,29.76 12.45,32.04 12.45,34.06 v12.42,34.09 | U$6.7 14.9,33.02 14.86,33.07 14.86,33.52 14.11,34.27 v14.11,34.41
  Bottom 0.305: v14.11,34.41 12.74,34.41 v12.42,34.09
C3_ACT_GND  (via drill 0.3, 0.35)
  Top 0.305: U$6.8 15.36,32.78 15.36,33.63 15.29,33.7 v15.29,33.99 | v7.95,30.5 6.72,30.5 6.55,30.33 6.54,30.34 v3.94,30.34 | C7.2 9.62,19.27 ACTUATOR_2.2 3.75,19.27 3.05,19.98 v3.05,20.77
  Bottom 0.127: 8.15,30.52 7.97,30.52 v7.95,30.5
  Bottom 0.305: v15.29,33.99 14.8,33.99 13.92,33.11 11,33.11 9.68,31.79 9.41,31.79 8.15,30.52 | v3.05,20.77 3.05,29.63 3.76,30.34 v3.94,30.34
C4_ACT_GND  (via drill 0.35)
  Top 0.127: 7.94,11.24 ACTUATOR_3.2
  Top 0.305: C8.2 10.03,11.24 7.94,11.24 | ACTUATOR_3.2 5.24,11.27 2.81,13.7 v2.81,14.45 | v5.03,34.29 7.77,37.03 11.68,37.03 12.05,36.66 14.3,36.66 15.88,35.09 15.88,32.76 U$6.9
  Bottom 0.305: v2.81,14.45 1.33,15.93 1.33,31.01 4.61,34.29 v5.03,34.29
COM  (via drill 0.35)
  Top 0.305: U$6.10 16.93,32.73 v17.08,32.58 | v11.11,32 10.16,32.96 C5.1 | ACTUATOR_0.1 6.83,31.67 3.26,31.67 2.74,31.15 2.74,31.08 v2.77,31.05 | ACTUATOR_2.1 6.88,17.74 6.88,17.94 6.47,18.35 v4.45,18.35 | v2.35,25.78 4.9,25.78 5.33,25.35 v5.77,25.35
  Top 0.508: ACTUATOR_0.1 8.5,33.34 C5.1 | ACTUATOR_1.1 8.88,25.72 C6.1 | ACTUATOR_2.1 7.99,16.83 C7.1 | ACTUATOR_3.1 8.37,9.21 C8.1 | v14.9,4.25 15.96,3.19 29.93,3.19 31.22,1.91 36.11,1.91 39.29,5.09 v39.37,5.09 | JP4.2 40.53,34.18 v40.64,34.29
  Bottom 0.305: v17.08,32.58 11.85,32.58 11.25,31.98 11.14,31.98 v11.11,32 | v2.77,31.05 2.35,30.63 v2.35,25.78 2.35,19.95 3.71,18.59 4.03,18.59 4.27,18.35 v4.45,18.35 4.45,10.12 5.84,8.73 ACTUATOR_3.1 | v5.77,25.35 7.27,25.35 ACTUATOR_1.1
  Bottom 0.508: ACTUATOR_3.1 7.89,7.02 10.65,4.25 v14.9,4.25 | v39.37,5.09 39.99,5.09 41.31,6.41 41.31,11.73 42.24,12.66 42.24,32.69 v40.64,34.29
D2_FLASHMISO  (via drill 0.3)
  Top 0.127: v24.32,24.51 24.32,24.64 24.77,25.08 25.02,25.08 U$9.23 | v25.02,30.35 v25.02,26.42 | v30.1,36.13 30.42,35.81 30.42,32.96 30.23,32.77 U6.2
  Bottom 0.127: v24.32,24.51 24.32,24.77 25.02,25.46 v25.02,26.42 | v25.02,30.35 25.02,31.05 v30.1,36.13
D3_FLASHSCK
  Top 0.127: U$9.14 25.08,20.64 25.4,20.64 27.11,22.35 27.11,27.24 27.3,27.43 28,27.43 28.89,26.54 28.89,26.1 U6.6
D4_FLASHMOSI
  Top 0.127: U$9.13 25.08,20.13 25.4,20.13 27.62,22.35 27.62,26.04 U6.5
D5_HEALTH  (via drill 0.3)
  Top 0.127: U$9.24 25.1,25.64 25.51,25.64 25.83,25.32 v25.83,25.15 | v29.65,21.46 29.65,18.92 30.29,18.29 R3.2
  Bottom 0.127: v29.65,21.46 29.54,21.46 25.86,25.15 v25.83,25.15
D5_HEALTH_LED
  Top 0.127: D3.A 32.53,4.21 30.35,6.39 30.35,16.51 R3.1
D6_ACT1_PA20_B1_SIGNAL  (via drill 0.3)
  Top 0.127: v14.48,29.34 14.41,29.4 14.41,29.97 U$6.1 | v21.84,27.11 22.29,26.67 22.29,26.35 U$9.29
  Bottom 0.127: v14.48,29.34 14.8,29.34 15.24,29.78 15.68,29.78 17.4,28.07 17.4,27.5 17.78,27.11 v21.84,27.11
D7_ACT4_PA21_B4_SIGNAL  (via drill 0.3)
  Top 0.127: v15.88,28.96 15.88,29.97 U$6.4 | v21.4,25.59 21.78,25.97 21.78,26.29 U$9.30
  Bottom 0.127: v15.88,28.96 15.88,28.64 18.92,25.59 v21.4,25.59
D8_NEOPIX
  Top 0.127: U$9.11 23.88,19.37 23.88,18.41 24.19,18.1 24.19,16.51 22.92,15.24 LED1.1
D10_ACT2_PA18_B2_SIGNAL  (via drill 0.3)
  Top 0.127: v14.92,28.83 14.92,29.97 U$6.2 | v23.05,25.59 23.05,25.72 23.3,25.97 23.3,26.29 U$9.27
  Bottom 0.127: v14.92,28.83 18.86,24.89 22.35,24.89 v23.05,25.59
D12_ACT3_PA19_B3_SIGNAL  (via drill 0.3)
  Top 0.127: v15.43,29.34 15.43,29.97 U$6.3 | v22.42,25.59 22.8,25.97 22.8,26.29 U$9.28
  Bottom 0.127: v15.43,29.34 15.43,28.7 18.99,25.15 21.97,25.15 v22.42,25.59
D14_HB
  Top 0.127: R9.2 28.43,16.36 28.43,14.81 28.17,14.54 22.29,14.54 22.16,14.67 22.16,16.38 19.88,18.67 19.88,19.37 U$9.3
D14_HB_LED
  Top 0.127: HB_LED.A 32.7,6.79 31.34,8.15 31.34,16.92 30.92,17.34 29.15,17.34 28.26,18.22 R9.1
EN
  Top 0.127: R15.2 23.43,29.65 23.43,31.37 U4.3
FLASH_CS
  Top 0.127: 30.92,31.36 30.92,31.37 28.51,31.37 28.38,31.5 28.38,33.72 27.5,34.61 27.5,34.99 R16.1 | 30.92,31.36 30.92,25.08 25.27,19.43 24.38,19.43 U$9.12 | U6.1 31.46,31.89 30.92,31.36
GND  (via drill 0.3)
  Top 0.254: U$9.42 17.54,23.11 17.23,22.8 16.81,22.8 16.51,23.09 16.51,23.51 16.55,23.55 16.55,23.91 v16.22,24.24 | U$9.35 19.34,25.11 v20.05,24.4 | U$9.THERMAL 22.84,21.61 v22.84,21.12
  Top 0.305: C2.2 28.79,35.74 U$2.P2
  other vias: 3.81,26.67 7.53,26.02 11.43,26.95 11.43,25.68 7.7,22.54 3.81,21.87 5.49,25.96 5.49,22.15 6.35,17.72 3.81,18.06 3.81,14.25 10.16,14.25 8.79,17.84 5.56,15.49 7.29,12.51 5.38,12.6 10.12,24.59 8.71,22.87 7.51,20.83 4.48,20.28 13.03,14.14 12.37,11.11 13.02,8.5 20.64,10.76 22.5,7.44 19.88,7.01 24.64,13.63 24.63,15.51 26.59,19.04 28.78,19.77 33.74,19.2 31.97,15 31.97,11.19 31.72,6.77 30.45,5.5 27.91,10.58 35.53,9.31 34.26,14.39 34.26,11.85 39.34,13.12 35.55,17.14 35.55,22.23 35.59,19.75 39.4,22.29 32.69,25.29 29.39,28.92 32,30.53 32.49,29.6 35.81,29.26 35.81,30.53 35.81,34.34 35.81,36.88 32.98,33.92 40.23,32.36 40.21,30.62 40.21,26.81 43.57,27.7 43.57,32.78 42.3,36.59 39.76,36.59 39.76,42.94 35.95,41.67 32.23,41.11 30.87,42.94 28.33,42.94 21.98,40.4 19.44,40.4 20.71,42.94 15.63,42.94 8.88,36.26 11.42,36.26 3.8,36.26 3.8,38.8 2.53,33.72 3.8,28.64 3.8,23.56 0.76,21.88 0.76,25.69 0.76,29.5 0.76,15.53 0.76,18.07 2.53,18.57 2.53,16.03 2.53,12.22 5.07,7.14 2.53,9.68 2.53,5.87 8.88,2.96 8.88,0.79 16.5,13.49 18.96,16.59 21.35,16.04 25.08,18.64 20.36,21.12 21.63,21.12 20.05,23.13 21.42,24.4 22.83,22.39 26.2,29.2 26.2,27.93 24.49,34.8 26.64,33.9 23.1,32.73 20.52,30.43 17.74,29.29 19.01,28.02 16.9,25.48 15.2,27.44 13.14,33.71 16.85,33.82 29.96,30.43 15.63,23.41 15.51,21.18 21.21,28.57 20.36,35.39 21.84,35.43 22.78,35.45 22.31,38.47 19.77,38.47 18.07,35.56 30.73,24.26 29.57,24.56 28.69,28.18 31.52,27.9 34.94,26.81 32.99,22 31.39,21.88 31.45,19 26.07,21.96 22.3,16.93 22.12,18.19 23.36,16.5 21.37,14.15 18.83,11.61 27.98,15.02 29.35,15.09 29.59,22.31 17.11,37.85 5.07,37.53 5.07,40.07 6.34,33.72 14.3,14.14 14.3,15.41 12.37,9.84 6.02,9.84 8.62,4.39 14.29,6.18 25.78,9.31 27.91,9.26 33.48,36.88 29.67,39.42 24.59,39.42 12.69,31.18 11.43,29.49 9.08,29.02 10.3,30.91 5.71,31.05 25.98,24.07 24.71,43.12 8.74,34.29 42.3,34.05 33.45,20.85 33.45,23.39 38.53,23.39 38.53,20.85 31.46,17.67 22.95,10.55 19.2,14.96 14.22,10.26 14.92,12.41 17.54,6.79 17.06,19.68 13.94,26.76 14.01,37.97 34.61,39.51 27.52,37.97 28.66,24.07 25.88,26.85 28.4,20.98 32.69,26.56 33.96,25.29 39.04,26.56 37.77,17.67 36.5,7.51 33.67,2.83 33.66,0.86 29.84,0.86 38.73,2.13 33.58,9.5 29.46,17.78 29.46,16.54 30.84,15.48 30.84,11.67 30.84,7.86 32.09,9.5 32.4,2.83 34.94,2.83 40.55,6.71 39.56,6.24 42.3,9.84 39.76,9.84 43.57,6.03 42.9,26.29
  pour Top: 54.61,49.53 54.61,-3.81 -5.08,-3.81 -5.08,49.53
  pour Bottom: 55.88,49.53 55.88,-2.54 -6.35,-2.54 -6.35,49.53
INT4  (via drill 0.3)
  Top 0.127: v22.82,18.58 22.82,19.38 U$9.9
  Bottom 0.127: v22.82,18.58 22.82,11.2 20.13,8.51 20.13,7.49 20.77,6.86 27.62,6.86 28.7,7.94 U$1.P6
INT5  (via drill 0.3)
  Top 0.127: v23.37,20.13 23.37,19.43 U$9.10
  Bottom 0.127: v23.37,20.13 23.37,24.19 24.57,25.4 24.57,26.99 23.3,28.26 22.1,28.26 21.84,28.51 21.84,32.58 22.04,32.77 22.04,34.58 19.66,36.96 18.8,36.96 U$2.P6
N$5
  Top 0.127: D2.A 32.7,16.38 32.58,16.51 R2.1
N$15
  Top 0.127: U$9.1 18.8,19.37 18.8,17.4 17.91,16.51 X2.P$1 17.97,16.51 18.61,15.88 18.61,13.59 17.84,12.83 17.84,12.51 C17.1
N$17
  Top 0.127: U$9.2 19.37,19.37 19.37,17.34 20.19,16.51 X2.P$2 20.32,16.45 C18.1
SCL  (via drill 0.3)
  Top 0.127: U$9.32 20.84,27.26 20.57,27.65 20.57,29.07 18.8,30.85 18.8,34.54 20.13,35.88 22.67,35.88 23.75,36.96 U$2.P4 | v30.23,19.19 30.23,20.56 R11.1 30.61,20.95 30.1,21.46 v30.1,21.84
  Bottom 0.127: v30.23,19.19 26.04,15 26.04,10.22 23.81,8 U$1.P4 | v30.1,21.84 30.1,23.32 23.81,29.6 23.81,36.96 U$2.P4
SCL_SENSOR_D13  (via drill 0.3)
  Top 0.127: v23.75,27.12 23.75,26.38 U$9.26 | v35,24.74 35,26 33.62,27.38 R6.1 | v24.48,18.55 24.64,18.72 24.64,18.83 24.9,19.09 25.52,19.09 v26.71,20.28
  Top 0.152: v34.29,22.86 34.29,24.03 v35,24.74
  Bottom 0.127: v23.75,27.12 24.25,26.63 24.25,25.5 22.38,23.62 22.38,19.62 22.45,19.55 23.49,19.55 v24.48,18.55 | 33.91,19.91 31.4,19.91 31.03,20.28 v26.71,20.28
  Bottom 0.152: U$4.P3 35.06,24.68 v35,24.74 | 33.91,19.91 34.58,20.58 34.58,22.57 v34.29,22.86
SDA  (via drill 0.3)
  Top 0.127: v22.29,28.7 22.29,28.07 21.78,27.56 21.65,27.56 21.4,27.3 21.4,26.35 U$9.31 | R10.1 30.61,23.05 v29.53,23.05 27.48,21.01 27.48,15.66 v27.61,15.53
  Bottom 0.127: U$2.P5 21.34,36.96 22.29,36.01 v22.29,28.7 23.37,28.7 29.02,23.05 v29.53,23.05 | v27.61,15.53 26.29,14.21 26.29,8 U$1.P5
SDA_SENSOR_D11  (via drill 0.3)
  Top 0.127: v24.51,29.53 24.51,26.51 24.38,26.38 U$9.25 | 35.25,30.91 v34.4,31.77 34.4,32.15 34.21,32.34 R5.1
  Top 0.152: v35.56,27.94 35.25,28.25 35.25,30.91
  Bottom 0.127: v24.51,29.53 24.58,29.6 25.6,29.6 27.12,31.12 30.12,31.12
  Bottom 0.152: U$4.P4 36.39,27.94 v35.56,27.94 | 30.12,31.12 33.75,31.12 v34.4,31.77
SWCLK  (via drill 0.3, 0.35)
  Top 0.127: v17.3,21.65 18.1,21.65 U$9.45
  Top 0.15: v16.05,22.17 16.57,21.65 v17.3,21.65
  Bottom 0.127: U$5.P$3 9.97,20.32 12.19,18.1 13.97,18.1 14.22,18.35 14.49,18.35 14.9,18.76 14.9,19.02 17.3,21.43 17.3,21.59
  Bottom 0.15: 17.3,21.59 v17.3,21.65 | JP5.4 15.37,22.86 v16.05,22.17
SWDIO
  Top 0.127: 17.21,21.14 18.1,21.14 U$9.46
  Top 0.15: JP5.2 15.21,23.11 15.21,22.24 16.31,21.14 17.21,21.14
  Bottom 0.127: U$5.P$2 7.18,24.13 7.49,23.81 11.56,23.81 12.64,24.89 13.4,24.89 14.16,24.13 JP5.2
USB_D_N
  Top 0.152: U$9.33 20.34,27.02 20.24,27.11 20.24,28.79 18.27,30.76 18.27,34.23 15.15,37.35 12.34,37.35 10.64,39.05 10.64,39.12 10.63,39.13 10.81,39.31 J1.2
USB_D_P
  Top 0.152: U$9.34 19.84,27.02 19.94,27.11 19.94,28.66 17.97,30.63 17.97,34.1 15.44,36.63 15.23,36.63 14.82,37.05 12.21,37.05 10.16,39.09 J1.3
VBUS  (via drill 0.3, 0.35)
  Top 0.254: v9.46,32.32 9.46,30.86 6.86,28.26 6.86,24.32 7.68,23.5 10.1,23.5 C11.1 | J1.1 11.49,40.26 11.49,39.37 12.7,38.16 v12.93,38.1
  Top 0.508: JP1.1 13.74,38.91 v12.93,38.1 | v21.51,32.95 21.51,31.44 | 21.51,31.44 U4.1 | R15.1 21.51,29.86 21.51,31.44
  Bottom 0.254: 13.37,36.23 v9.46,32.32
  Bottom 0.508: v12.93,38.1 12.93,36.68 13.37,36.23 14.96,34.65 21.29,34.65 21.51,34.42 v21.51,32.95
VDDANA  (via drill 0.3)
  Top 0.127: v21.46,18.61 21.4,18.67 21.4,19.37 U$9.6 | C4.1 14.41,17.08 15.72,18.39 v16.38,18.39 16.38,19.74 v16.32,19.8 | v15.62,25.72 14.35,25.72 L1.2
  Bottom 0.127: v21.46,18.61 20.98,18.12 16.65,18.12 v16.38,18.39 | v15.62,25.72 15.93,25.72 17.83,23.81 17.83,21.14 17.71,21.14 17.41,20.84 17.36,20.84 v16.32,19.8
VDDCORE1
  Top 0.127: C16.1 12.64,27.81 13.46,26.99 13.46,25.27 13.72,25.02 14.75,25.02
  Top 0.15: U$9.43 17.54,22.61 17.37,22.45 16.66,22.45 16.16,22.95 16.16,23.58 15.68,24.06 15.68,24.09 14.75,25.02

### Text on the board
_tsilk: Port A | 5V: | BP: | Service / only | Sensor | RobotPatient.com | Ext. PWR | PWR | HB | Reset | Health | Port B
_bsilk: Cortex M0 / SAMD21 | RobotPatient.com | Designed for / ManikinOS